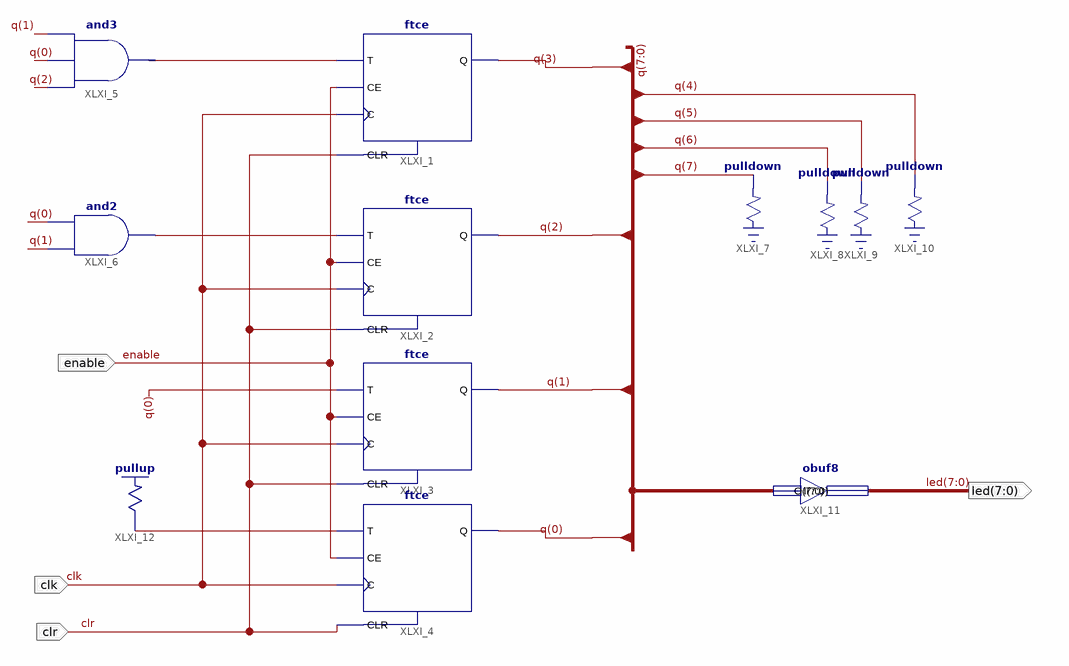
[diagram p0: schematic sheet 1]
// Xilinx ISE schematic szamlalo.sch (spartan3e) as structural Verilog: 12 symbols, 4 ports
module szamlalo (
  input  clr,
  input  clk,
  input  enable,
  output [7:0] led
);

  wire XLXN_13, XLXN_14, XLXN_33;
  wire [7:0] q;

  ftce XLXI_1 (.C(clk), .CE(enable), .CLR(clr), .T(XLXN_13), .Q(q[3]));
  ftce XLXI_2 (.C(clk), .CE(enable), .CLR(clr), .T(XLXN_14), .Q(q[2]));
  ftce XLXI_3 (.C(clk), .CE(enable), .CLR(clr), .T(q[0]), .Q(q[1]));
  ftce XLXI_4 (.C(clk), .CE(enable), .CLR(clr), .T(XLXN_33), .Q(q[0]));
  and XLXI_5 (XLXN_13, q[2], q[0], q[1]);
  and XLXI_6 (XLXN_14, q[1], q[0]);
  \pulldown  XLXI_7 (.O(q[7]));
  \pulldown  XLXI_8 (.O(q[6]));
  \pulldown  XLXI_9 (.O(q[5]));
  \pulldown  XLXI_10 (.O(q[4]));
  obuf8 XLXI_11 (.I(q), .O(led));
  \pullup  XLXI_12 (.O(XLXN_33));
endmodule
